# Altium project LED_MAT_3.PRJPCB (part 2 of 2)

## Sheet Power.SchDoc: Power
size A3; DocumentNumber: Power; Revision: 2.0; SheetNumber: 6; SheetTotal: 7; Engineer: Dim Su; ContentRev1: Original Document; dateREV1: "Aug/31/2018"; dateREV2: "Sep/03/2018"; ContentRev2: Corrections to PSU IC; Rev1: V1; Rev2: V2; Project: LED_MAT_3
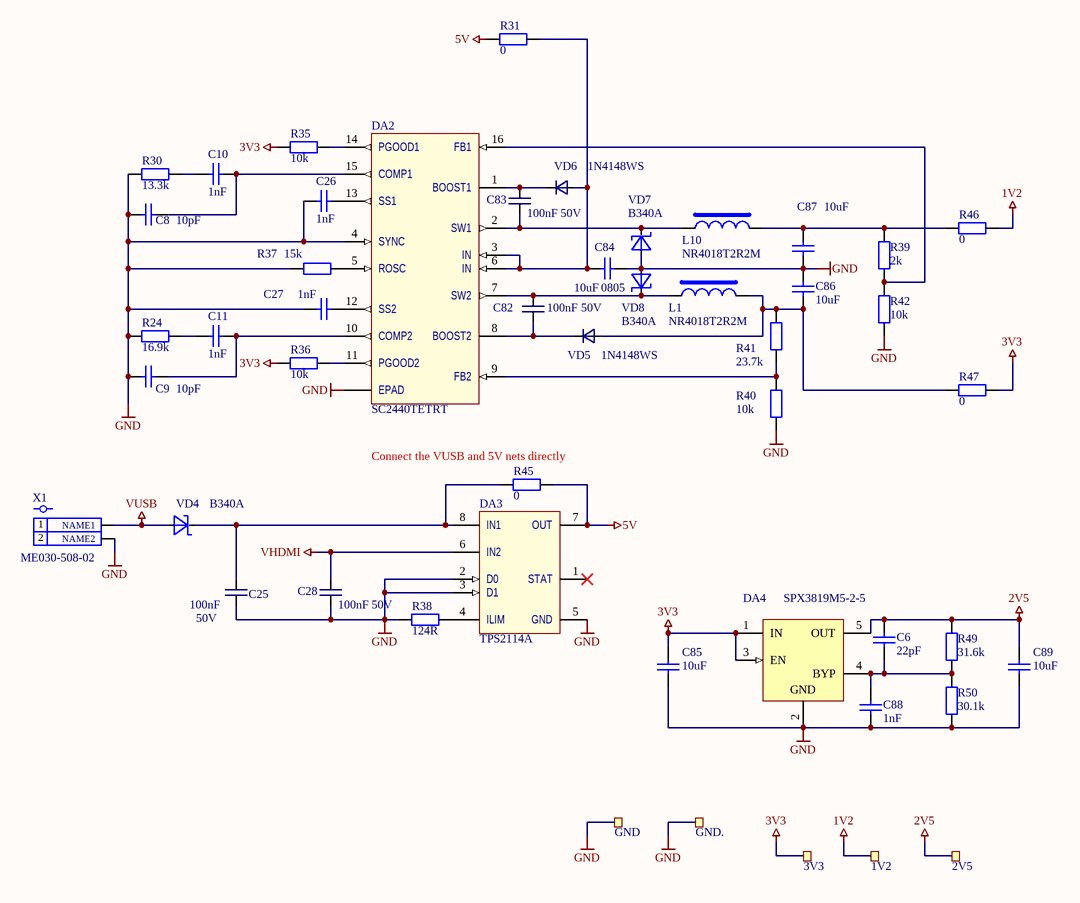
[diagram p5: Power.SchDoc]

### Parts
1V2  TP_TH  [TP_TH_1MM]  (value not drawn)  (no BOM)
2V5  Ø1.0mm,SMD  [TP_SMD_1MM]  (value not drawn)  (no BOM)
3V3  TP_TH  [TP_TH_1MM]  (value not drawn)  (no BOM)
C6  value 22pF  [CAPC1608L]  (hidden comment: 22pF / 0603 / COG / 50V)
C8  value 10pF  [CAPC1608L]  (hidden comment: 10pF / 0603 / COG / 50V)
C9  value 10pF  [CAPC1608L]  (hidden comment: 10pF / 0603 / COG / 50V)
C10  value 1nF  [CAPC1608L]  (hidden comment: 1nF / 0603 / NPO / 50V)
C11  value 1nF  [CAPC1608L]  (hidden comment: 1nF / 0603 / NPO / 50V)
C25  100nF  Voltage: 50V  [CAPC1608L]
C26  value 1nF  [CAPC1608L]  (hidden comment: 1nF / 0603 / NPO / 50V)
C27  value 1nF  [CAPC1608L]  (hidden comment: 1nF / 0603 / NPO / 50V)
C28  100nF  Voltage: 50V  [CAPC1608L]
C82  100nF  Voltage: 50V  [CAPC1608L]
C83  100nF  Voltage: 50V  [CAPC1608L]
C84  value 10uF  Package: 0805  [CAPC2012L]  (hidden comment: 10uF / 0805 /  X5R / 10V)
C85  value 10uF  [CAPC2012L]  (hidden comment: 10uF / 0805 /  X5R / 10V)
C86  value 10uF  [CAPC2012L]  (hidden comment: 10uF / 0805 /  X5R / 10V)
C87  value 10uF  [CAPC2012L]  (hidden comment: 10uF / 0805 /  X5R / 10V)
C88  value 1nF  [CAPC1608L]  (hidden comment: 1nF / 0603 / NPO / 50V)
C89  value 10uF  [CAPC2012L]  (hidden comment: 10uF / 0805 /  X5R / 10V)
DA2  SC2440TETRT  [TSOP65P640X110_HS320X320-16L]
DA3  TPS2114A  [TSSOP65P640X120-8L]
DA4  SPX3819M5-2-5  [TI-DBV6_N]
GND  TP_TH  [TP_TH_1MM]  (value not drawn)  (no BOM)
GND.  TP_TH  [TP_TH_1MM]  (value not drawn)  (no BOM)
L1  NR4018T2R2M  [IND_CD43]
L10  NR4018T2R2M  [IND_CD43]
R24  value 16.9k  [RESC1608L]  (hidden comment: 16.9k / 1% / 0603)
R30  value 13.3k  [RESC1608L]  (hidden comment: 13.3k / 1% / 0603)
R31  value 0  [RESC3216L]  (hidden comment: 0 / 1% / 0603)
R35  value 10k  [RESC1608L]  (hidden comment: 10k / 1% / 0603 / TC100 / 50V / 0.1W)
R36  value 10k  [RESC1608L]  (hidden comment: 10k / 1% / 0603 / TC100 / 50V / 0.1W)
R37  value 15k  [RESC1608L]  (hidden comment: 15k / 1% / 0603)
R38  value 124R  [RESC1608L]  (hidden comment: 124R / 1% / 0603)
R39  value 2k  [RESC1608L]  (hidden comment: 2k / 1% / 0603)
R40  value 10k  [RESC1608L]  (hidden comment: 10k / 1% / 0603 / TC100 / 50V / 0.1W)
R41  value 23.7k  [RESC1608L]  (hidden comment: 23.7k / 1% / 0603)
R42  value 10k  [RESC1608L]  (hidden comment: 10k / 1% / 0603 / TC100 / 50V / 0.1W)
R45  value 0  [RESC1608L]  (hidden comment: 0 / 1% / 0603)
R46  value 0  [RESC1608L]  (hidden comment: 0 / 1% / 0603)
R47  value 0  [RESC1608L]  (hidden comment: 0 / 1% / 0603)
R49  value 31.6k  [RESC1608L]  (hidden comment: 31.6k / 1% / 0603)
R50  value 30.1k  [RESC1608L]  (hidden comment: 30.1k / 1% / 0603)
VD4  B340A  [DO-214AC(SMA)]
VD5  1N4148WS  [SOD123]
VD6  1N4148WS  [SOD123]
VD7  B340A  [DO-214AC(SMA)]
VD8  B340A  [DO-214AC(SMA)]
X1  ME030-508-02  [ME030-508-02]

### Nets
1V2: 1V2.1 R46.2
2V5: 2V5.1 C6.1 C89.2 DA4.5(OUT) R49.2
3V3: 3V3.1 C85.2 DA4.1(IN) DA4.3(EN) R35.1 R36.1 R47.2
5V: DA3.7(OUT) R31.1 R45.2
GND: C8.2 C9.2 C25.2 C26.1 C27.1 C28.1 C84.1 C85.1 C86.1 C87.1 C88.1 C89.1 DA2.4(SYNC) DA2.EPAD DA3.2(D0) DA3.3(D1) DA3.5(GND) DA4.2(GND) GND.1 GND..1 R24.1 R30.1 R37.1 R38.2 R40.2 R42.2 R50.1 VD7.1 VD8.1 X1.2(NAME2)
VHDMI: C28.2 DA3.6(IN2)
VUSB: VD4.1 X1.1(NAME1)
NetC6_2: C6.2 C88.2 DA4.4(BYP) R49.1 R50.2
NetC8_1: C8.1 C10.1 DA2.15(COMP1)
NetC9_1: C9.1 C11.1 DA2.10(COMP2)
NetC10_2: C10.2 R30.2
NetC11_2: C11.2 R24.2
NetC25_1: C25.1 DA3.8(IN1) R45.1 VD4.2
NetC26_2: C26.2 DA2.13(SS1)
NetC27_2: C27.2 DA2.12(SS2)
NetC82_1: C82.1 DA2.8(BOOST2) VD5.2
NetC82_2: C82.2 DA2.7(SW2) L1.1 VD8.2
NetC83_1: C83.1 DA2.2(SW1) L10.1 VD7.2
NetC83_2: C83.2 DA2.1(BOOST1) VD6.2
NetC84_2: C84.2 DA2.3(IN) DA2.6(IN) R31.2 VD6.1
NetC86_2: C86.2 L1.2 R41.1 R47.1 VD5.1
NetC87_2: C87.2 L10.2 R39.1 R46.1
NetDA2_5: DA2.5(ROSC) R37.2
NetDA2_9: DA2.9(FB2) R40.1 R41.2
NetDA2_11: DA2.11(PGOOD2) R36.2
NetDA2_14: DA2.14(PGOOD1) R35.2
NetDA2_16: DA2.16(FB1) R39.2 R42.1
NetDA3_4: DA3.4(ILIM) R38.1

Not connected (* = marked no-connect by the designer): DA3 1(STAT)*

### Notes on the sheet
- (near R45) Connect the VUSB and 5V nets directly
- Title
- Size:
- Date:
- A3
- Number:
- Time:
- Revision:
- Sheet
- of
- File:

### Library data of the parts
1V2 3V3 GND GND. = TESTPAD_TH: Testpoint, through hole; Manufacturer: *; Manufacturer Part Number: *; Value: TP_TH; Supplier: *; Category: Pattern
2V5 = TESTPAD_SMD: circular SMD testpad 1mm; Manufacturer Part Number: *; Value: Ø1.0mm,SMD; Supplier: *; Category: Pattern
C6 C8 C9 = 10pF / 0603 / COG / 50V: Capacitor ceramic; Manufacturer: SAMSUNG; Manufacturer Part Number: CL10C100JB8NNNC; Tolerance: 5%; Package: 0603; Voltage: 50V; CompName: Capacitor; Category: Capacitor; Price: 0.2; Type: COG
C10 C11 C26 C27 C88 = 1nF / 0603 / NPO / 50V: Capacitor ceramic; Manufacturer: MURATA; Manufacturer Part Number: GRM1885C1H102JA01D; Tolerance: 5%; Package: 0603; Voltage: 50V; CompName: Capacitor; Category: Capacitor; Price: 0.2; Type: NPO
C25 C28 C82 C83 = Capacitor CC0805 100nF C0G: Capacitor SMD; Manufacturer: SAMSUNG; Manufacturer Part Number: CL21B104KBCNNNC; Tolerance: 5%; CompName: Capacitor; Value: 100nF; Package: 0805; Price: 0.07
C84-C87 C89 = 10uF / 0805 /  X5R / 10V: Capacitor ceramic; Voltage: 10V; CompName: Capacitor; Price: 0.2
  C85-C87 C89: Package: 0805
DA2 = SC2440: 2.5 MHz Dual Switching Regulator, 2A; CompName: IC; Manufacturer: SEMTECH; CompKind: 0; CompType: SC2440TETRT; ValueBOM: SC2440TETRT; Manufacturer Part Number: SC2440TETRT; Package: TSSOP-16; Price: 43.16
DA3 = TPS2114A: AUTOSWITCHING POWER MUX; CompName: IC; Manufacturer: TI; Manufacturer Part Number: TPS2114A; Price: 1; Value: TPS2114A
DA4 = SPX3819M5-2-5: 500mA, Low-Noise LDO Voltage Regulator; Manufacturer: SIPEX; Tolerance: 1%; Voltage: 2.5V; ComponentLink1Description: Manufacturer URL; ComponentLink1URL: http://www.ti.com/; ComponentLink2Description: Datasheet; ComponentLink2URL: http://www.ti.com/general/docs/lit/getliterature.tsp?genericPartNumber=TPS79301&fileType=pdf; ComponentLink3Description: Package Specification; ComponentLink3URL: http://www.ti.com/litv/pdf/mpds026h; ComponentLink4Description: URL Link1; ComponentLink4URL: Samples URL:http://www.ti.com/product/tps79301#samples; Manufacturer Part Number: SPX3819M5-2-5; Package: SOT23-5; Price: 5.2; Type: IC; Value: SPX3819M5-2-5
L1 L10 = 2.2uH Power Choke: Power choke; CompName: Inductor; Manufacturer: TAIYO YUDE; Value: 2.2uH; Manufacturer Part Number: NR4018T2R2M; Package: 0404; Price: 3.14
R24 = 16.9k / 1% / 0603: Manufacturer: YAGEO; Manufacturer Part Number: RC0603FR0716K9L; CompName: Resistor; Remarks: replaceable; Tolerance: 1%; Package: 0603; Category: Resistor; Price: 0.02; Supplier: ./.; Supplier Order Code: ./.; Temperature: -40...+85°C
R30 = 13.3k / 1% / 0603: Manufacturer: YAGEO; Manufacturer Part Number: RC0603FR-0713K3L; CompName: Resistor; Remarks: replaceable; Tolerance: 1%; Package: 0603; Category: Resistor; Price: 0.03; Supplier: ./.; Supplier Order Code: ./.; Temperature: -40...+85°C
R31 R45-R47 = 2k / 1% / 0603: Manufacturer: YAGEO; Manufacturer Part Number: RC0603FR-070RL; CompName: Resistor; Remarks: replaceable; Tolerance: 1%; Package: 0603; Category: Resistor; Price: 0.02; Supplier: ./.; Supplier Order Code: ./.; Temperature: -40...+85°C
R35 R36 R40 R42 = 10k / 1% / 0603 / TC100 / 50V / 0.1W: Resistor; Tolerance: 1%; Package: 0603; Voltage: 50V; CompName: Resistor; Price: 0.02
R37 = 15k / 1% / 0603: Manufacturer: YAGEO; Manufacturer Part Number: RC0603FR-0715KL; CompName: Resistor; Remarks: replaceable; Tolerance: 1%; Package: 0603; Category: Resistor; Price: 0.03; Supplier: ./.; Supplier Order Code: ./.; Temperature: -40...+85°C
R38 R50 = 124R / 1% / 0603: Manufacturer: PANASONIC; Manufacturer Part Number: ERJ-3EKF1240V; CompName: Resistor; Remarks: replaceable; Tolerance: 1%; Package: 0603; Category: Resistor; Price: 0.02; Supplier: ./.; Supplier Order Code: ./.; Temperature: -40...+85°C
R39 = 2k / 1% / 0603: Manufacturer: YAGEO; Manufacturer Part Number: RC0603FR-072KL; CompName: Resistor; Remarks: replaceable; Tolerance: 1%; Package: 0603; Category: Resistor; Price: 0.02; Supplier: ./.; Supplier Order Code: ./.; Temperature: -40...+85°C
R41 = 23.7k / 1% / 0603: Manufacturer: YAGEO; Manufacturer Part Number: RC0603FR-0723K7L; CompName: Resistor; Remarks: replaceable; Tolerance: 1%; Package: 0603; Category: Resistor; Price: 0.02; Supplier: ./.; Supplier Order Code: ./.; Temperature: -40...+85°C
R49 = 39R / 1% / 0603: Manufacturer: YAGEO; Manufacturer Part Number: RC0603FR-0739RL; CompName: Resistor; Remarks: replaceable; Tolerance: 1%; Package: 0603; Category: Resistor; Price: 0.02; Supplier: ./.; Supplier Order Code: ./.; Temperature: -40...+85°C
VD4 VD7 VD8 = B360A: Shottky restifiers, 2A, SMA Package; CompName: Diode; Manufacturer: DIODES; Voltage: 40V; Manufacturer Part Number: B340A; Package: DO214AC; Value: B340A
  VD4: Price: 1
  VD7 VD8: Price: 1.4; Type: Diode
VD5 VD6 = 1N4148W: Fast switching diode; Manufacturer: VISHAY; Manufacturer Part Number: 1N4148WS-E3-08; CompName: Diode; Package: SOD323; Price: 0.35; Value: 1N4148WS
X1 = CON2_TermBlock: 2-pin HPWR connector; Manufacturer: DECA SWITC; CompName: Connector; Manufacturer Part Number: ME030-508-02; Price: 3.21; Value: ME030-508-02

## Sheet PSRAM.SchDoc: RAM
size A4; Revision: 2.0; SheetNumber: 7; SheetTotal: 7; DrawnBy: Dim Su; Engineer: DS; ContentRev1: Original Document; dateREV1: "Aug/31/2018"; dateREV2: "Sep/03/2018"; ContentRev2: Change the caps params; Rev1: V1; Rev2: V2; Project: LET_MAT_3
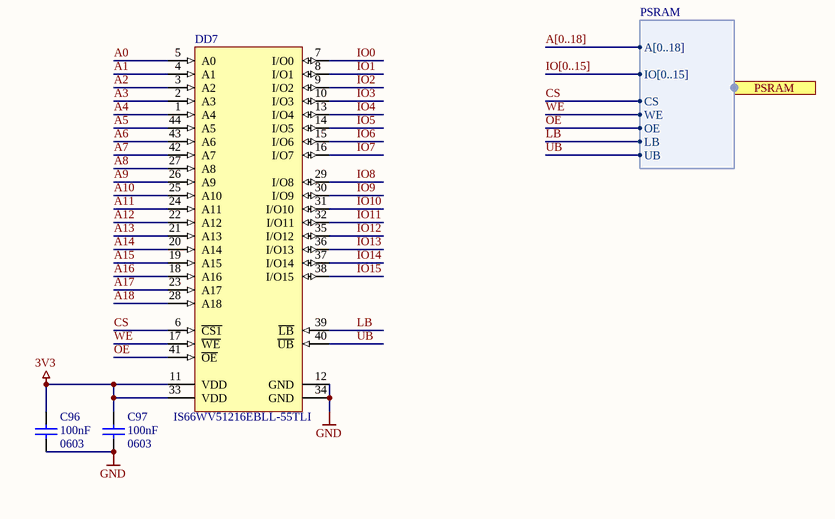
[diagram p6: PSRAM.SchDoc]

### Parts
C96  value 100nF  Package: 0603  [CAPC1608L]  (hidden comment: 100nF / 0603 / X7R / 16V)
C97  value 100nF  Package: 0603  [CAPC1608L]  (hidden comment: 100nF / 0603 / X7R / 16V)
DD7  IS66WV51216EBLL-55TLI  [ISSI-TSOP-2-44_N]

### Ports
PSRAM (harness PSRAM)

### Harnesses
PSRAM: A[0..18], IO[0..15], CS, WE, OE, LB, UB

### Nets
3V3: C96.2 C97.2 DD7.11(VDD) DD7.33(VDD)
GND: C96.1 C97.1 DD7.12(GND) DD7.34(GND)
A0: DD7.5(A0)
A1: DD7.4(A1)
A2: DD7.3(A2)
A3: DD7.2(A3)
A4: DD7.1(A4)
A5: DD7.44(A5)
A6: DD7.43(A6)
A7: DD7.42(A7)
A8: DD7.27(A8)
A9: DD7.26(A9)
A10: DD7.25(A10)
A11: DD7.24(A11)
A12: DD7.22(A12)
A13: DD7.21(A13)
A14: DD7.20(A14)
A15: DD7.19(A15)
A16: DD7.18(A16)
A17: DD7.23(A17)
A18: DD7.28(A18)
CS: DD7.6(~{CS1}) ; port PSRAM.CS
IO0: DD7.7(I/O0)
IO1: DD7.8(I/O1)
IO2: DD7.9(I/O2)
IO3: DD7.10(I/O3)
IO4: DD7.13(I/O4)
IO5: DD7.14(I/O5)
IO6: DD7.15(I/O6)
IO7: DD7.16(I/O7)
IO8: DD7.29(I/O8)
IO9: DD7.30(I/O9)
IO10: DD7.31(I/O10)
IO11: DD7.32(I/O11)
IO12: DD7.35(I/O12)
IO13: DD7.36(I/O13)
IO14: DD7.37(I/O14)
IO15: DD7.38(I/O15)
LB: DD7.39(~{LB}) ; port PSRAM.LB
OE: DD7.41(~{OE}) ; port PSRAM.OE
UB: DD7.40(~{UB}) ; port PSRAM.UB  [project net PSRAM_UB]
WE: DD7.17(~{WE}) ; port PSRAM.WE  [project net PSRAM_WE]

### Buses and harness runs
bus A[0..18]
bus IO[0..15]

### Notes on the sheet
- Title
- Size:
- Date:
- A4
- Number:
- Time:
- Revision:
- Sheet
- of
- File:

### Library data of the parts
C96 C97 = 100nF / 0603 / X7R / 16V: Capacitor ceramic; Manufacturer: *; Manufacturer Part Number: *; Voltage: 16V; CompName: Capacitor; Price: 0.2
DD7 = IS66WV51216DBLL-55TLI: 8 M Low Voltage, Ultra Low Power Pseudo CMOS SRAM, 512 K x 16, -40 to 85 degC, 44-Pin SOP (TSOP-2-44), Pb-Free; Manufacturer: Integrated Silicon Solution Inc (ISSI); CompName: IC; Organization: 512K x 16; Manufacturer Part Number: IS66WV51216DBLL-55TLI; Price: 2

## Nets that join several sheets
1V2: S3_LED_MAT_FPGA_POWER (27 pins), Power (1V2.1 R46.2)
2V5: S3_LED_MAT_FPGA_POWER (L4.2), Power (5 pins)
3V3: S3_LED_MAT_FPGA (23 pins), S3_LED_MAT_FPGA_POWER (48 pins), S1_LED_MAT_HDMI (42 pins), Power (7 pins), PSRAM (C96.2 C97.2 DD7.11 DD7.33)
5V: H1 (9 pins), S1_LED_MAT_HDMI (R13.1), H2 (9 pins), H3 (9 pins), Power (DA3.7 R31.1 R45.2)
GND: Top (P4.4 P4.16), H1 (18 pins), S3_LED_MAT_FPGA (23 pins), S3_LED_MAT_FPGA_POWER (82 pins), S1_LED_MAT_HDMI (69 pins), H2 (18 pins), H3 (18 pins), Power (30 pins), PSRAM (C96.1 C97.1 DD7.12 DD7.34)
VHDMI: S1_LED_MAT_HDMI (10 pins), Power (C28.2 DA3.6)
VUSB: S1_LED_MAT_HDMI (DA1.5 DD4.8 J1.1), Power (VD4.1 X1.1)
A0: S3_LED_MAT_FPGA (DD5.F16), PSRAM (DD7.5)
A1: S3_LED_MAT_FPGA (DD5.E16), PSRAM (DD7.4)
A2: S3_LED_MAT_FPGA (DD5.E15), PSRAM (DD7.3)
A3: S3_LED_MAT_FPGA (DD5.D16), PSRAM (DD7.2)
A4: S3_LED_MAT_FPGA (DD5.D15), PSRAM (DD7.1)
A5: S3_LED_MAT_FPGA (DD5.A8), PSRAM (DD7.44)
A6: S3_LED_MAT_FPGA (DD5.B8), PSRAM (DD7.43)
A7: S3_LED_MAT_FPGA (DD5.A7), PSRAM (DD7.42)
A8: S3_LED_MAT_FPGA (DD5.B5), PSRAM (DD7.27)
A9: S3_LED_MAT_FPGA (DD5.A4), PSRAM (DD7.26)
A10: S3_LED_MAT_FPGA (DD5.B4), PSRAM (DD7.25)
A11: S3_LED_MAT_FPGA (DD5.A3), PSRAM (DD7.24)
A12: S3_LED_MAT_FPGA (DD5.J15 R55.1 SW1.4), PSRAM (DD7.22)
A13: S3_LED_MAT_FPGA (DD5.J16 R54.1 SW1.3), PSRAM (DD7.21)
A14: S3_LED_MAT_FPGA (DD5.H15 R53.1 SW1.2), PSRAM (DD7.20)
A15: S3_LED_MAT_FPGA (DD5.H16 R52.1 SW1.1), PSRAM (DD7.19)
A16: S3_LED_MAT_FPGA (DD5.G15), PSRAM (DD7.18)
A17: S3_LED_MAT_FPGA (DD5.B3), PSRAM (DD7.23)
A18: S3_LED_MAT_FPGA (DD5.A5), PSRAM (DD7.28)
B0: S3_LED_MAT_FPGA (DD5.T13), S1_LED_MAT_HDMI (P2.21 U1.10)
B1: S3_LED_MAT_FPGA (DD5.T12), S1_LED_MAT_HDMI (P2.22 U1.11)
B2: S3_LED_MAT_FPGA (DD5.R12), S1_LED_MAT_HDMI (P2.23 U1.12)
B3: S3_LED_MAT_FPGA (DD5.T11), S1_LED_MAT_HDMI (P2.24 U1.13)
B4: S3_LED_MAT_FPGA (DD5.R11), S1_LED_MAT_HDMI (P2.25 U1.14)
B5: S3_LED_MAT_FPGA (DD5.R10), S1_LED_MAT_HDMI (P2.26 U1.15)
B6: S3_LED_MAT_FPGA (DD5.T9), S1_LED_MAT_HDMI (P2.27 U1.16)
B7: S3_LED_MAT_FPGA (DD5.R9), S1_LED_MAT_HDMI (P2.28 U1.17)
BL_ON: S3_LED_MAT_FPGA (DD5.L15), S1_LED_MAT_HDMI (R18.2 R48.2)
CS: S3_LED_MAT_FPGA (DD5.G14), PSRAM (DD7.6)
DE: S3_LED_MAT_FPGA (DD5.P1), S1_LED_MAT_HDMI (R19.1 U1.46)
DPI_PCLK: S3_LED_MAT_FPGA (R7.1), S1_LED_MAT_HDMI (P2.30 PCLK.1 R60.1 U1.44)
FPGA_HPD: S3_LED_MAT_FPGA (DD5.R15), S1_LED_MAT_HDMI (R11.2 R12.1)
G0: S3_LED_MAT_FPGA (DD5.T8), S1_LED_MAT_HDMI (P2.13 U1.20)
G1: S3_LED_MAT_FPGA (DD5.R8), S1_LED_MAT_HDMI (P2.14 U1.21)
G2: S3_LED_MAT_FPGA (DD5.T7), S1_LED_MAT_HDMI (P2.15 U1.22)
G3: S3_LED_MAT_FPGA (DD5.R7), S1_LED_MAT_HDMI (P2.16 U1.23)
G4: S3_LED_MAT_FPGA (DD5.T6), S1_LED_MAT_HDMI (P2.17 U1.24)
G5: S3_LED_MAT_FPGA (DD5.R6), S1_LED_MAT_HDMI (P2.18 U1.25)
G6: S3_LED_MAT_FPGA (DD5.T5), S1_LED_MAT_HDMI (P2.19 U1.26)
G7: S3_LED_MAT_FPGA (DD5.R5), S1_LED_MAT_HDMI (P2.20 U1.27)
H_A0: Top (P4.9), H1 (DD2_1.18 P3_1.14)
H_A1: Top (P4.10), H1 (DD2_1.17 P3_1.15)
H_A2: Top (P4.11), H1 (DD2_1.16 P3_1.16)
H_A3: Top (P4.12), H1 (DD1_1.12 P3_1.11)
H_A4: Top (P4.8), H1 (DD1_1.13 P3_1.12)
H_B0: Top (P4.3), H1 (DD3_1.16 P3_1.3)
H_B1: Top (P4.7), H1 (DD3_1.11 P3_1.6)
H_CLK: Top (DCLK.1 P4.13), H1 (DD2_1.14 P3_1.17)
H_G0: Top (P4.2), H1 (DD3_1.17 P3_1.2)
H_G1: Top (P4.6), H1 (DD3_1.12 P3_1.5)
H_LT: Top (P4.14), H1 (DD2_1.12 P3_1.18)
H_OE: Top (P4.15), H1 (DD2_1.11 P3_1.19)
H_R0: Top (P4.1), H1 (DD3_1.18 P3_1.1)
H_R1: Top (P4.5), H1 (DD3_1.13 P3_1.4)
HSYNC: S3_LED_MAT_FPGA (DD5.N1), S1_LED_MAT_HDMI (P2.32 U1.48)
HUB1_B0: H1 (DD3_1.4), S3_LED_MAT_FPGA (DD5.C3)
HUB1_B1: H1 (DD3_1.9), S3_LED_MAT_FPGA (DD5.C6)
HUB1_B2: H1 (DD1_1.4), S3_LED_MAT_FPGA (DD5.E10)
HUB1_G0: H1 (DD3_1.3), S3_LED_MAT_FPGA (DD5.E3)
HUB1_G1: H1 (DD3_1.8), S3_LED_MAT_FPGA (DD5.C5)
HUB1_G2: H1 (DD1_1.3), S3_LED_MAT_FPGA (DD5.E9)
HUB1_R0: H1 (DD3_1.2), S3_LED_MAT_FPGA (DD5.F4)
HUB1_R1: H1 (DD3_1.7), S3_LED_MAT_FPGA (DD5.C4)
HUB1_R2: H1 (DD1_1.2), S3_LED_MAT_FPGA (DD5.D9)
HUB2_B0: S3_LED_MAT_FPGA (DD5.N5), H2 (DD3_2.4)
HUB2_B1: S3_LED_MAT_FPGA (DD5.K2), H2 (DD3_2.9)
HUB2_B2: S3_LED_MAT_FPGA (DD5.F1), H2 (DD1_2.4)
HUB2_G0: S3_LED_MAT_FPGA (DD5.N4), H2 (DD3_2.3)
HUB2_G1: S3_LED_MAT_FPGA (DD5.L2), H2 (DD3_2.8)
HUB2_G2: S3_LED_MAT_FPGA (DD5.G2), H2 (DD1_2.3)
HUB2_R0: S3_LED_MAT_FPGA (DD5.P4), H2 (DD3_2.2)
HUB2_R1: S3_LED_MAT_FPGA (DD5.L1), H2 (DD3_2.7)
HUB2_R2: S3_LED_MAT_FPGA (DD5.J2), H2 (DD1_2.2)
HUB3_B0: S3_LED_MAT_FPGA (DD5.P12), H3 (DD3_3.4)
HUB3_B1: S3_LED_MAT_FPGA (DD5.P9), H3 (DD3_3.9)
HUB3_B2: S3_LED_MAT_FPGA (DD5.P5), H3 (DD1_3.4)
HUB3_G0: S3_LED_MAT_FPGA (DD5.P13), H3 (DD3_3.3)
HUB3_G1: S3_LED_MAT_FPGA (DD5.P10), H3 (DD3_3.8)
HUB3_G2: S3_LED_MAT_FPGA (DD5.P6), H3 (DD1_3.3)
HUB3_R0: S3_LED_MAT_FPGA (DD5.P14), H3 (DD3_3.2)
HUB3_R1: S3_LED_MAT_FPGA (DD5.P11), H3 (DD3_3.7)
HUB3_R2: S3_LED_MAT_FPGA (DD5.P8), H3 (DD1_3.2)
HUB_A0: H1 (DD2_1.2), S3_LED_MAT_FPGA (DD5.D1), H2 (DD2_2.2), H3 (DD2_3.2)
HUB_A1: H1 (DD2_1.3), S3_LED_MAT_FPGA (DD5.C1), H2 (DD2_2.3), H3 (DD2_3.3)
HUB_A2: H1 (DD2_1.4), S3_LED_MAT_FPGA (DD5.C2), H2 (DD2_2.4), H3 (DD2_3.4)
HUB_A3: H1 (DD1_1.8), S3_LED_MAT_FPGA (DD5.E1), H2 (DD1_2.8), H3 (DD1_3.8)
HUB_A4: H1 (DD1_1.7), S3_LED_MAT_FPGA (DD5.F2), H2 (DD1_2.7), H3 (DD1_3.7)
HUB_CLK: H1 (DD2_1.6), S3_LED_MAT_FPGA (R9.1), H2 (DD2_2.6), H3 (DD2_3.6)
HUB_LT: H1 (DD2_1.8), S3_LED_MAT_FPGA (DD5.B1), H2 (DD2_2.8), H3 (DD2_3.8)
HUB_OE: H1 (DD2_1.9), S3_LED_MAT_FPGA (DD5.B2), H2 (DD2_2.9), H3 (DD2_3.9)
IO0: S3_LED_MAT_FPGA (DD5.C16), PSRAM (DD7.7)
IO1: S3_LED_MAT_FPGA (DD5.C15), PSRAM (DD7.8)
IO2: S3_LED_MAT_FPGA (DD5.B16), PSRAM (DD7.9)
IO3: S3_LED_MAT_FPGA (DD5.B15), PSRAM (DD7.10)
IO4: S3_LED_MAT_FPGA (DD5.A14), PSRAM (DD7.13)
IO5: S3_LED_MAT_FPGA (DD5.C14), PSRAM (DD7.14)
IO6: S3_LED_MAT_FPGA (DD5.A13), PSRAM (DD7.15)
IO7: S3_LED_MAT_FPGA (DD5.B13), PSRAM (DD7.16)
IO8: S3_LED_MAT_FPGA (DD5.A12), PSRAM (DD7.29)
IO9: S3_LED_MAT_FPGA (DD5.B12), PSRAM (DD7.30)
IO10: S3_LED_MAT_FPGA (DD5.A11), PSRAM (DD7.31)
IO11: S3_LED_MAT_FPGA (DD5.B11), PSRAM (DD7.32)
IO12: S3_LED_MAT_FPGA (DD5.A10), PSRAM (DD7.35)
IO13: S3_LED_MAT_FPGA (DD5.B10), PSRAM (DD7.36)
IO14: S3_LED_MAT_FPGA (DD5.A9), PSRAM (DD7.37)
IO15: S3_LED_MAT_FPGA (DD5.B9), PSRAM (DD7.38)
LB: S3_LED_MAT_FPGA (DD5.B6), PSRAM (DD7.39)
OE: S3_LED_MAT_FPGA (DD5.B7), PSRAM (DD7.41)
PSRAM_UB: S3_LED_MAT_FPGA (DD5.A6), PSRAM (DD7.40)
PSRAM_WE: S3_LED_MAT_FPGA (DD5.G16), PSRAM (DD7.17)
R0: S3_LED_MAT_FPGA (DD5.T4), S1_LED_MAT_HDMI (P2.5 U1.30)
R1: S3_LED_MAT_FPGA (DD5.R4), S1_LED_MAT_HDMI (P2.6 U1.31)
R2: S3_LED_MAT_FPGA (DD5.T3), S1_LED_MAT_HDMI (P2.7 U1.32)
R3: S3_LED_MAT_FPGA (DD5.R3), S1_LED_MAT_HDMI (P2.8 U1.33)
R4: S3_LED_MAT_FPGA (DD5.T2), S1_LED_MAT_HDMI (P2.9 U1.34)
R5: S3_LED_MAT_FPGA (DD5.R2), S1_LED_MAT_HDMI (P2.10 U1.35)
R6: S3_LED_MAT_FPGA (DD5.R1), S1_LED_MAT_HDMI (P2.11 U1.36)
R7: S3_LED_MAT_FPGA (DD5.P2), S1_LED_MAT_HDMI (P2.12 U1.37)
RXD: S3_LED_MAT_FPGA (DD5.L16), S1_LED_MAT_HDMI (DD4.26 R4.2)
SCL: S3_LED_MAT_FPGA (R26.1), S1_LED_MAT_HDMI (R44.2 U4.3)
SDA: S3_LED_MAT_FPGA (R23.1), S1_LED_MAT_HDMI (R51.2 U4.4)
TXD: S3_LED_MAT_FPGA (DD5.K15), S1_LED_MAT_HDMI (DD4.25 R3.2)
VSYNC: S3_LED_MAT_FPGA (DD5.N2), S1_LED_MAT_HDMI (P2.33 U1.47)

## Assembly variants
LED_MAT_3 - Trial Run: not fitted C96 C97 DA3 DD7 R13 R20
LED_MAT_3 - 2nd Run: not fitted C6 C28 C81 C96 C97 DA3 DD7 R13 R20 R38 R49 R50